# Altium schematic sheet Connectors.SchDoc
size A4; SheetNumber: 3; SheetTotal: 3
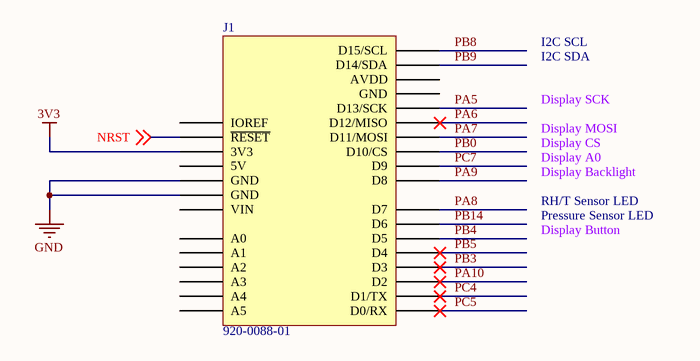
[diagram p0: Connectors.SchDoc]

## Parts
J1  920-0088-01  [SCHMARTBOARD - 920-0088-01]

## Nets
3V3: J1.4(3V3)
GND: J1.6(GND) J1.7(GND)
NRST: J1.3(~{RESET}) ; off-sheet NRST
PA5: J1.28(D13/SCK)
PA6: J1.27(D12/MISO)
PA7: J1.26(D11/MOSI)
PA8: J1.22(D7)
PA9: J1.23(D8)
PA10: J1.17(D2)
PB0: J1.25(D10/CS)
PB3: J1.18(D3)
PB4: J1.20(D5)
PB5: J1.19(D4)
PB8: J1.32(D15/SCL)
PB9: J1.31(D14/SDA)
PB14: J1.21(D6)
PC4: J1.16(D1/TX)
PC5: J1.15(D0/RX)
PC7: J1.24(D9)

Not connected (* = marked no-connect by the designer): J1 2(IOREF) 5(5V) 8(VIN) 9(A0) 10(A1) 11(A2) 12(A3) 13(A4) 14(A5) 29(GND) 30(AVDD)

## Notes on the sheet
- I2C SCL
- I2C SDA
- Display CS
- Display SCK
- Display MOSI
- Display A0
- Pressure Sensor LED
- Display Button
- Display Backlight
- RH/T Sensor LED

## Library data of the parts
J1 = 920-0088-01: CONN HDR 8/10P 0.1 GOLD PCB 6PC; Manufacturer: Schmartboard, Inc.; Connector Type: Header; Contact Length - Post: 0.413" (10.50mm); Number of Positions: 6, 8, 10; Number of Positions Loaded: All; Pitch - Mating: 0.100" (2.54mm); Style: Board to Board; System: Connector; Part Number: 920-0088-01; ComponentLink1Description: Datasheet; ComponentLink1URL: http://schmartboard.com/content/Brochures/920-0088-01.pdf; ComponentLink2Description: DigiKey Link; ComponentLink2URL: http://digikey.com/product-detail/en/schmartboard-inc/920-0088-01/1988-1036-ND/9559319; Contact Finish - Mating: Gold; Contact Finish - Post: Gold; Contact Type: Female Socket; Fastening Type: Push-Pull; Insulation Color: Black; Insulation Height: 0.335" (8.51mm); LastUpdated: 31/01/2020 20:49:58; Lifecycle Status: Active; Minimum Order: 1; Mounting Type: Through Hole; Number of Rows: 1; Packaging: Bulk; Part Status: Active; Price: 5.00; Series: -; Supplier 1: DigiKey; Supplier Part Number 1: 1988-1036-ND; Termination: Solder